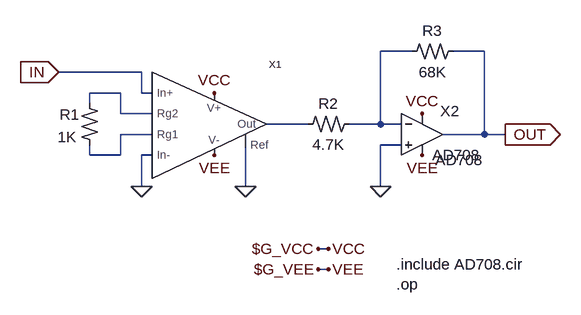
[diagram p0: schematic Boltz-1-preamp.asc]
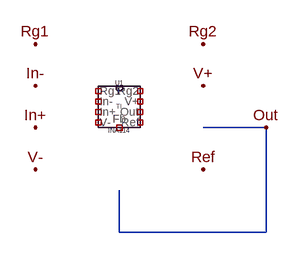
[diagram p1: sub-circuit ina114-opamp.asc]
Boltz-1-preamp.asc, the LTspice schematic file:
Version 4
SHEET 1 884 680
WIRE 592 256 544 256
WIRE 704 256 656 256
WIRE 176 288 48 288
WIRE 144 320 96 320
WIRE 176 320 176 288
WIRE 192 320 176 320
WIRE 96 336 96 320
WIRE 144 352 144 320
WIRE 192 352 144 352
WIRE 432 368 368 368
WIRE 544 368 544 256
WIRE 544 368 496 368
WIRE 576 368 544 368
WIRE 192 384 144 384
WIRE 704 384 704 256
WIRE 704 384 640 384
WIRE 736 384 704 384
WIRE 576 400 544 400
WIRE 96 416 96 400
WIRE 144 416 144 384
WIRE 144 416 96 416
WIRE 192 416 176 416
WIRE 176 464 176 416
WIRE 336 464 336 400
WIRE 544 464 544 400
WIRE 464 560 448 560
WIRE 464 592 448 592
FLAG 176 464 0
FLAG 336 464 0
FLAG 544 464 0
FLAG 736 384 OUT
IOPIN 736 384 Out
FLAG 48 288 IN
IOPIN 48 288 In
FLAG 464 560 VCC
FLAG 608 352 VCC
FLAG 288 320 VCC
FLAG 288 416 VEE
FLAG 608 416 VEE
FLAG 464 592 VEE
FLAG 448 560 $G_VCC
FLAG 448 592 $G_VEE
SYMBOL Opamps/UniversalOpamp2 608 384 R0
WINDOW 0 28 -36 Left 2
WINDOW 38 20 39 Left 2
SYMATTR InstName X2
SYMATTR SpiceModel AD708
SYMATTR Value AD708
SYMBOL res2 496 352 R90
WINDOW 0 0 32 VBottom 2
WINDOW 3 32 32 VTop 2
SYMATTR InstName R2
SYMATTR Value 4.7K
SYMBOL res2 80 336 R0
WINDOW 0 -30 17 Left 2
WINDOW 3 -33 52 Left 2
SYMATTR InstName R1
SYMATTR Value 1K
SYMBOL res2 656 240 R90
WINDOW 0 0 32 VBottom 2
WINDOW 3 32 32 VTop 2
SYMATTR InstName R3
SYMATTR Value 68K
SYMBOL INA114-OPAMP 320 368 R0
SYMATTR InstName X1
TEXT 568 584 Left 2 !.include AD708.cir\n.op

ina114-opamp.asc, the sub-circuit schematic file:
Version 4
SHEET 1 880 680
WIRE 512 416 416 416
WIRE 288 576 288 512
WIRE 512 576 512 416
WIRE 512 576 288 576
FLAG 160 288 Rg1
FLAG 160 352 In-
FLAG 160 416 In+
FLAG 160 480 V-
FLAG 416 352 V+
FLAG 416 288 Rg2
FLAG 512 416 Out
FLAG 416 480 Ref
SYMBOL INA114 288 384 R0
SYMATTR InstName U1

The netlist it stands for:
* Boltz-1-preamp.asc
XX2 0 N001 $G_VCC $G_VEE OUT AD708 AD708 Avol=1Meg GBW=10Meg Slew=10Meg ilimit=25m rail=0 Vos=0 phimargin=45 en=0 enk=0 in=0 ink=0 Rin=500Meg  ; pins IN+ IN- V+ V- OUT
R2 N001 N003 4.7K
R1 N002 N004 1K
R3 OUT N001 68K
XX1 N004 0 IN $G_VEE 0 N003 $G_VCC N002 ina114-opamp

* block symbol definitions
.subckt ina114-opamp Rg1 In- In+ V- Ref Out V+ Rg2
XU1 NC_01 NC_02 NC_03 NC_04 NC_05 NC_06 NC_07 NC_08 NC_09 INA114  ; pins In+ In- V+ V- Out Fb Ref Rg1 Rg2
.ends ina114-opamp

.include AD708.cir
.op
.lib UniversalOpamps2.sub
.lib INA114.sub
.backanno
.end